# Altium schematic sheet extension.SchDoc
size A3
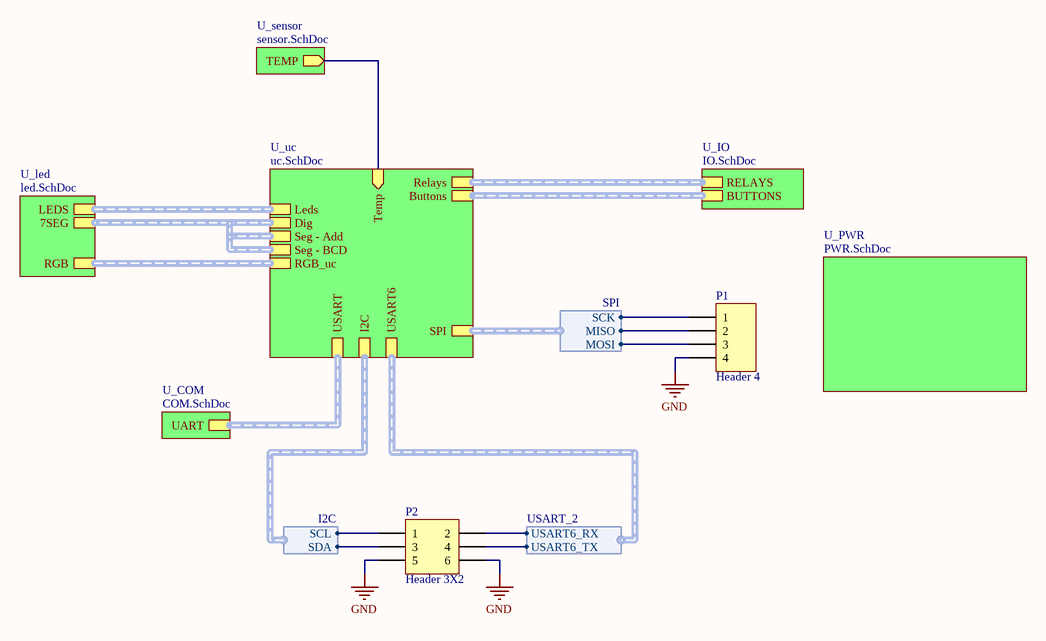
[diagram p0: extension.SchDoc]

## Parts
P1  Header 4  [HDR1X4]
P2  Header 3X2  [HDR2X3]

## Sub-sheets
U_COM = COM.SchDoc: UART (harness UART)
U_IO = IO.SchDoc: RELAYS (harness Relays), BUTTONS (harness Buttons)
U_led = led.SchDoc: LEDS (harness LEDS), 7SEG (harness 7SEG), RGB (harness RGB)
U_PWR = PWR.SchDoc: no entries
U_sensor = sensor.SchDoc: TEMP (out)
U_uc = uc.SchDoc: USART (harness USART), Leds (harness Leds), Relays (harness Relays), Buttons (harness Buttons), Dig (harness DIG), Seg - Add (harness Seg Add), Seg - BCD (harness Seg BCD), I2C (harness I2C), SPI (harness SPI), USART6 (harness USART_2), RGB_uc (harness RGB), Temp (in)

## Harnesses
USART_2: USART6_TX, USART6_RX
SPI: MOSI, MISO, SCK
I2C: SDA, SCL

## Nets
GND: P1.4 P2.5 P2.6
NetP1_1: P1.1 ; sheet U_uc/SPI.SCK
NetP1_2: P1.2 ; sheet U_uc/SPI.MISO
NetP1_3: P1.3 ; sheet U_uc/SPI.MOSI
NetP2_1: P2.1 ; sheet U_uc/I2C.SCL
NetP2_2: P2.2 ; sheet U_uc/USART6.USART6_RX
NetP2_3: P2.3 ; sheet U_uc/I2C.SDA
NetP2_4: P2.4 ; sheet U_uc/USART6.USART6_TX
(unnamed): sheet U_uc/Temp, sheet U_sensor/TEMP

## Buses and harness runs
harness sheet U_COM/UART = sheet U_uc/USART
harness sheet U_IO/BUTTONS = sheet U_uc/Buttons
harness sheet U_IO/RELAYS = sheet U_uc/Relays
harness sheet U_led/7SEG = sheet U_uc/Dig = sheet U_uc/Seg - Add = sheet U_uc/Seg - BCD
harness sheet U_led/LEDS = sheet U_uc/Leds
harness sheet U_led/RGB = sheet U_uc/RGB_uc

## Notes on the sheet
- 1
- 2
- 3
- 4
- 5
- 6
- 7
- 8
- A
- B
- C
- D
- Project:
- Date:
- Drawing number:
- Rev:
- Format:
- A3
- Drawn by:
- Laboratory:
- Page
- Sheet:
- of
- File:

## Library data of the parts
P1 = Header 4: Header, 4-Pin
P2 = Header 3X2: Header, 3-Pin, Dual row